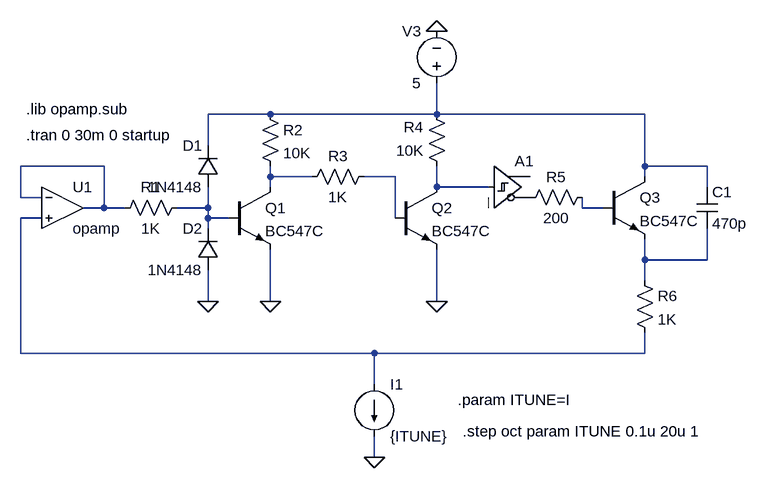
[diagram p0: schematic test_with.asc]
test_with.asc, the LTspice schematic file:
Version 4
SHEET 1 1188 680
WIRE 416 0 320 0
WIRE 672 0 672 -48
WIRE 672 0 416 0
WIRE 992 0 672 0
WIRE 320 48 320 0
WIRE 160 80 32 80
WIRE 992 80 992 0
WIRE 1088 80 992 80
WIRE 416 96 416 80
WIRE 480 96 416 96
WIRE 608 96 560 96
WIRE 992 96 992 80
WIRE 416 112 416 96
WIRE 672 112 672 80
WIRE 752 112 672 112
WIRE 1088 112 1088 80
WIRE 32 128 32 80
WIRE 64 128 32 128
WIRE 160 144 160 80
WIRE 160 144 128 144
WIRE 192 144 160 144
WIRE 320 144 320 112
WIRE 320 144 272 144
WIRE 896 144 896 128
WIRE 928 144 896 144
WIRE 64 160 32 160
WIRE 320 160 320 144
WIRE 352 160 320 160
WIRE 608 160 608 96
WIRE 320 176 320 160
WIRE 992 224 992 192
WIRE 1088 224 1088 176
WIRE 1088 224 992 224
WIRE 992 256 992 224
WIRE 320 288 320 240
WIRE 416 288 416 208
WIRE 672 288 672 208
WIRE 32 368 32 160
WIRE 576 368 32 368
WIRE 992 368 992 336
WIRE 992 368 576 368
WIRE 576 416 576 368
WIRE 576 528 576 496
FLAG 320 288 0
FLAG 416 288 0
FLAG 672 288 0
FLAG 672 -128 0
FLAG 576 528 0
SYMBOL res 288 128 R90
WINDOW 0 0 56 VBottom 2
WINDOW 3 32 56 VTop 2
SYMATTR InstName R1
SYMATTR Value 1K
SYMBOL diode 336 112 R180
WINDOW 0 24 64 Left 2
WINDOW 3 24 0 Left 2
SYMATTR InstName D1
SYMATTR Value 1N4148
SYMBOL diode 336 240 R180
WINDOW 0 24 64 Left 2
WINDOW 3 24 0 Left 2
SYMATTR InstName D2
SYMATTR Value 1N4148
SYMBOL res 400 -16 R0
SYMATTR InstName R2
SYMATTR Value 10K
SYMBOL res 576 80 R90
WINDOW 0 0 56 VBottom 2
WINDOW 3 32 56 VTop 2
SYMATTR InstName R3
SYMATTR Value 1K
SYMBOL res 688 96 R180
WINDOW 0 36 76 Left 2
WINDOW 3 36 40 Left 2
SYMATTR InstName R4
SYMATTR Value 10K
SYMBOL npn 352 112 R0
SYMATTR InstName Q1
SYMATTR Value BC547C
SYMBOL npn 608 112 R0
SYMATTR InstName Q2
SYMATTR Value BC547C
SYMBOL Digital\\schmitt 752 48 R0
WINDOW 3 0 0 Invisible 2
SYMATTR Value VHigh=5 Vt=1.4 Vh=.45 Trise=.1u Tfall=.1u
SYMATTR InstName A1
SYMBOL npn 928 96 R0
SYMATTR InstName Q3
SYMATTR Value BC547C
SYMBOL res 912 112 R90
WINDOW 0 0 56 VBottom 2
WINDOW 3 32 56 VTop 2
SYMATTR InstName R5
SYMATTR Value 200
SYMBOL cap 1072 112 R0
SYMATTR InstName C1
SYMATTR Value 470p
SYMBOL res 976 240 R0
SYMATTR InstName R6
SYMATTR Value 1K
SYMBOL voltage 672 -32 R180
WINDOW 0 24 96 Left 2
WINDOW 3 24 16 Left 2
WINDOW 123 0 0 Left 2
WINDOW 39 0 0 Left 2
SYMATTR InstName V3
SYMATTR Value 5
SYMBOL current 576 416 R0
WINDOW 123 0 0 Left 2
WINDOW 39 0 0 Left 2
SYMATTR InstName I1
SYMATTR Value {ITUNE}
SYMBOL Opamps\\opamp 96 80 R0
SYMATTR InstName U1
TEXT 40 32 Left 2 !.tran 0 30m 0 startup
TEXT 40 -8 Left 2 !.lib opamp.sub
TEXT 704 440 Left 2 !.param ITUNE=I
TEXT 712 488 Left 2 !.step oct param ITUNE 0.1u 20u 1

The netlist it stands for:
* test_with.asc
R1 N006 N002 1K
D1 N006 N001 1N4148
D2 0 N006 1N4148
R2 N001 N003 10K
R3 N004 N003 1K
R4 N005 N001 10K
Q1 N003 N006 0 0 BC547C
Q2 N005 N004 0 0 BC547C
A1 N005 0 0 0 0 P001 0 0 SCHMITT VHigh=5 Vt=1.4 Vh=.45 Trise=.1u Tfall=.1u
Q3 N001 N007 N009 0 BC547C
R5 N007 P001 200
C1 N001 N009 470p
R6 N009 N008 1K
V3 N001 0 5
I1 N008 0 {ITUNE}
XU1 N002 N008 N002 opamp Aol=100K GBW=10Meg  ; pins invin noninvin out
.model D D
.lib standard.dio
.model NPN NPN
.model PNP PNP
.lib standard.bjt
.tran 0 30m 0 startup
.lib opamp.sub
.param ITUNE=I
.step oct param ITUNE 0.1u 20u 1
.backanno
.end